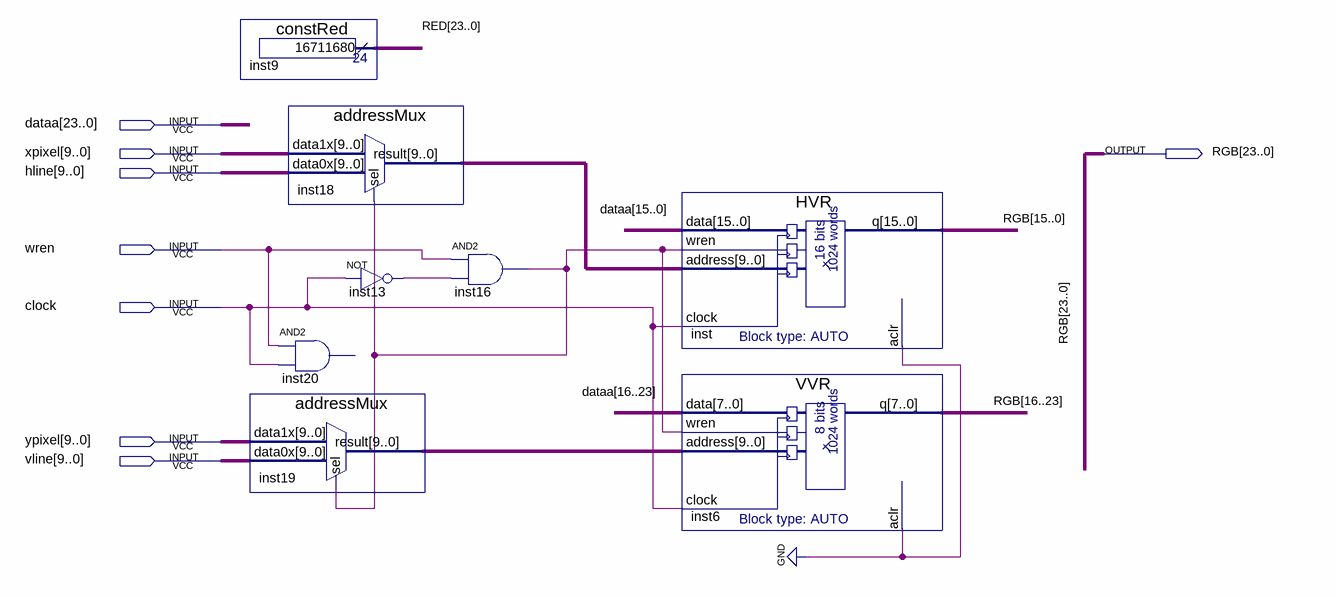
[diagram p0: schematic sheet]
// Quartus schematic color_register.bdf as structural Verilog: 8 symbols, 8 pins
module color_register (
  input  [23:0] dataa,
  input  [9:0] xpixel,
  input  [9:0] hline,
  input  wren,
  input  clock,
  input  [9:0] ypixel,
  input  [9:0] vline,
  output [23:0] RGB
);

  wire inst13_out, inst16_out;
  wire [9:0] inst18_result, inst19_result;
  wire [23:0] RED;

  constRed inst9 (.result(RED));
  addressMux inst18 (.data1x(xpixel), .data0x(hline), .sel(inst16_out), .result(inst18_result));
  // AND2 inst20 has open pins: IN1=wren, IN2=clock, OUT=open
  addressMux inst19 (.data1x(ypixel), .data0x(vline), .sel(inst16_out), .result(inst19_result));
  not inst13 (inst13_out, clock);
  and inst16 (inst16_out, wren, inst13_out);
  HVR inst (.data(dataa[15:0]), .wren(inst16_out), .address(inst18_result), .clock(clock), .aclr(1'b0), .q(RGB[15:0]));
  VVR inst6 (
    .data({dataa[16], dataa[17], dataa[18], dataa[19], dataa[20], dataa[21], dataa[22], dataa[23]}),
    .wren(inst16_out), .address(inst19_result), .clock(clock), .aclr(1'b0),
    .q({RGB[16], RGB[17], RGB[18], RGB[19], RGB[20], RGB[21], RGB[22], RGB[23]}));
endmodule
